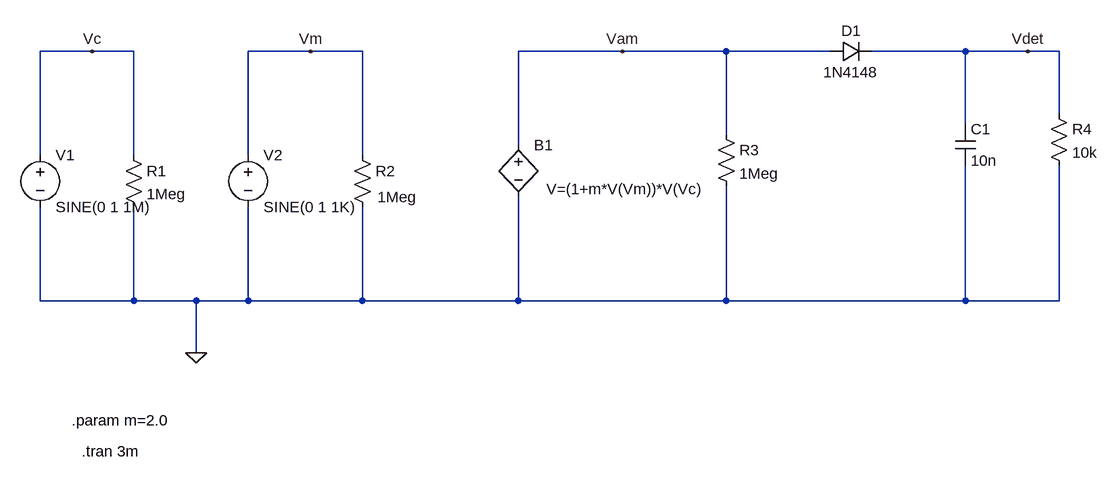
[diagram p0: schematic lab1-2.asc]
lab1-2.asc, the LTspice schematic file:
Version 4
SHEET 1 1200 680
WIRE -352 -112 -432 -112
WIRE -288 -112 -352 -112
WIRE -16 -112 -112 -112
WIRE 64 -112 -16 -112
WIRE 464 -112 304 -112
WIRE 624 -112 464 -112
WIRE 784 -112 624 -112
WIRE 992 -112 848 -112
WIRE 1088 -112 992 -112
WIRE 1136 -112 1088 -112
WIRE 1136 -16 1136 -112
WIRE 992 0 992 -112
WIRE 624 16 624 -112
WIRE 304 32 304 -112
WIRE -432 48 -432 -112
WIRE -288 48 -288 -112
WIRE -112 48 -112 -112
WIRE 64 48 64 -112
WIRE -432 272 -432 128
WIRE -288 272 -288 128
WIRE -288 272 -432 272
WIRE -192 272 -288 272
WIRE -112 272 -112 128
WIRE -112 272 -192 272
WIRE 64 272 64 128
WIRE 64 272 -112 272
WIRE 304 272 304 112
WIRE 304 272 64 272
WIRE 624 272 624 96
WIRE 624 272 304 272
WIRE 992 272 992 64
WIRE 992 272 624 272
WIRE 1136 272 1136 64
WIRE 1136 272 992 272
WIRE -192 352 -192 272
FLAG 464 -112 Vam
FLAG -16 -112 Vm
FLAG -352 -112 Vc
FLAG -192 352 0
FLAG 1088 -112 Vdet
SYMBOL bv 304 16 R0
WINDOW 3 43 84 Left 2
SYMATTR Value V=(1+m*V(Vm))*V(Vc)
SYMATTR InstName B1
SYMBOL res -304 32 R0
SYMATTR InstName R1
SYMATTR Value 1Meg
SYMATTR SpiceLine tol=1 pwr=0.1
SYMBOL res 48 32 R0
WINDOW 3 39 80 Left 2
SYMATTR Value 1Meg
SYMATTR InstName R2
SYMBOL res 608 0 R0
SYMATTR InstName R3
SYMATTR Value 1Meg
SYMBOL voltage -432 32 R0
WINDOW 123 0 0 Left 0
WINDOW 39 0 0 Left 0
SYMATTR InstName V1
SYMATTR Value SINE(0 1 1M)
SYMBOL voltage -112 32 R0
WINDOW 123 0 0 Left 0
WINDOW 39 0 0 Left 0
SYMATTR InstName V2
SYMATTR Value SINE(0 1 1K)
SYMBOL diode 784 -96 R270
WINDOW 0 32 32 VTop 2
WINDOW 3 0 32 VBottom 2
SYMATTR InstName D1
SYMATTR Value 1N4148
SYMBOL cap 976 0 R0
SYMATTR InstName C1
SYMATTR Value 10n
SYMBOL res 1120 -32 R0
SYMATTR InstName R4
SYMATTR Value 10k
TEXT -384 456 Left 2 !.param m=2.0
TEXT -368 504 Left 2 !.tran 3m

The netlist it stands for:
* lab1-2.asc
B1 Vam 0 V=(1+m*V(Vm))*V(Vc)
R1 Vc 0 1Meg tol=1 pwr=0.1
R2 Vm 0 1Meg
R3 Vam 0 1Meg
V1 Vc 0 SINE(0 1 1M)
V2 Vm 0 SINE(0 1 1K)
D1 Vam Vdet 1N4148
C1 Vdet 0 10n
R4 Vdet 0 10k
.model D D
.lib standard.dio
.param m=2.0
.tran 3m
.backanno
.end